# Altium schematic sheet RF_Antenna_Switch.SchDoc
size A4; DocumentNumber: 29; SheetNumber: 29; SheetTotal: 47
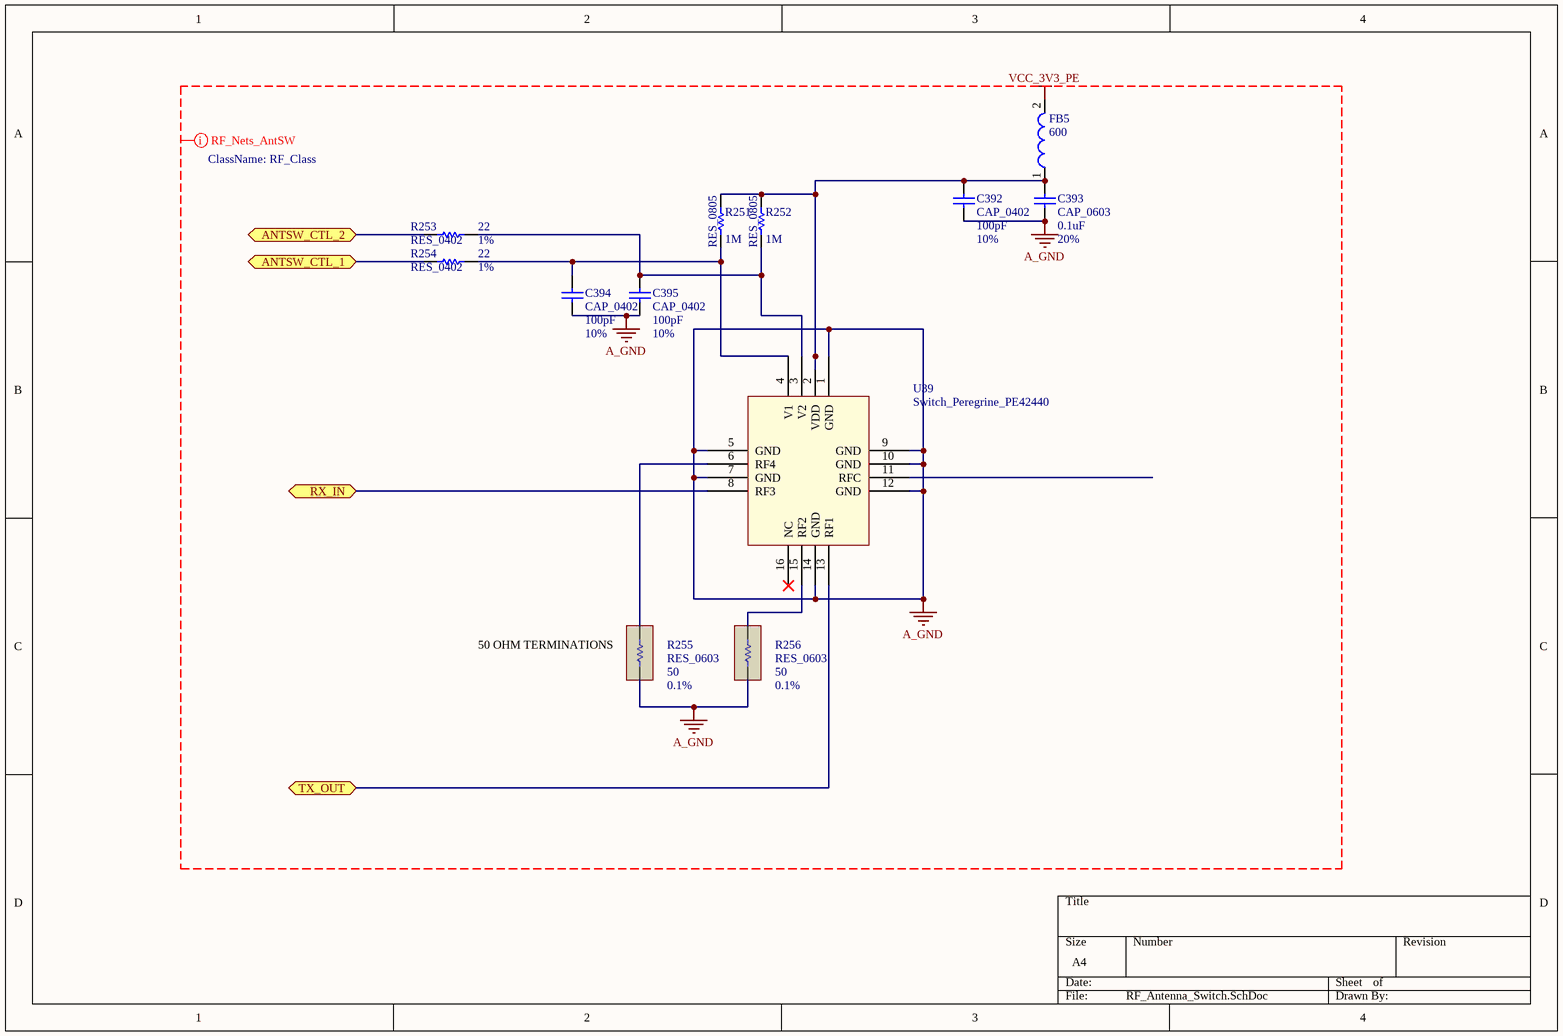
[diagram p0: RF_Antenna_Switch.SchDoc]

## Parts
C392  CAP_0402  value 100pF  Tolerance: 10%  [CAPC0402(1005)60_N]
C393  CAP_0603  value 0.1uF  Tolerance: 20%  [CAPC0603(1608)100_N]
C394  CAP_0402  value 100pF  Tolerance: 10%  [CAPC0402(1005)60_N]
C395  CAP_0402  value 100pF  Tolerance: 10%  [CAPC0402(1005)60_N]
FB5  Z: 600  [Inductor0402(1005)]  (hidden comment: FerriteBead)
R251  RES_0805  value 1M  [RESC0805(2012)_N]
R252  RES_0805  value 1M  [RESC0805(2012)_N]
R253  RES_0402  value 22  Tolerance: 1%  [RESC0402(1005)_N]
R254  RES_0402  value 22  Tolerance: 1%  [RESC0402(1005)_N]
R255  RES_0603  value 50  Tolerance: 0.1%  [RESC0603(1608)_N]
R256  RES_0603  value 50  Tolerance: 0.1%  [RESC0603(1608)_N]
U39  Switch_Peregrine_PE42440  [Switch_Peregrine_PE42440_16-QFN]

## Ports
ANTSW_CTL_1 (bidir), ANTSW_CTL_2 (bidir), RX_IN, TX_OUT

## Nets
A_GND: C392.1 C393.1 C394.1 C395.1 R255.1 R256.1 U39.1(GND) U39.5(GND) U39.7(GND) U39.9(GND) U39.10(GND) U39.12(GND) U39.14(GND)
VCC_3V3_PE: FB5.2
ANTSW_CTL_1: R254.1 ; port ANTSW_CTL_1
ANTSW_CTL_2: R253.1 ; port ANTSW_CTL_2
RX_IN: U39.8(RF3) ; port RX_IN
TX_OUT: U39.13(RF1) ; port TX_OUT
NetC392_2: C392.2 C393.2 FB5.1 R251.2 R252.2 U39.2(VDD)
NetC394_2: C394.2 R251.1 R254.2 U39.4(V1)
NetC395_2: C395.2 R252.1 R253.2 U39.3(V2)
NetR255_2: R255.2 U39.6(RF4)
NetR256_2: R256.2 U39.15(RF2)

Not connected (* = marked no-connect by the designer): U39 11(RFC) 16(NC)*

## Layout directives
net class RF_Class: A_GND, VCC_3V3_PE

## Notes on the sheet
- (near R255) 50 OHM TERMINATIONS

## Library data of the parts
C392 C394 C395 = 04026C101KAT2A: 100pF, ceramic, 10% 6.3V X7R, 0402; Manufacturer: AVX Corporation; Part Number: 04026C101KAT2A; Footprint Ref: CAPC0402(1005)60_N; Library Ref: CAP_0402
C393 = 6R3X14W104MV4T: CAP CER 0.1UF 6.3V 20% X7R 0603; Manufacturer: Johanson Dielectrics Inc; Part Number: 6R3X14W104MV4T; Footprint Ref: CAPC0603(1608)100_N; Library Ref: CAP_0603
FB5 = "MMZ1005S601C": Ferrite 300mA 600ohm 0402; Manufacturer: TDK; Value: "0 Ohm"; R: *; Current: *; Part Number: "MMZ1005S601C"
R251 R252 = 9C08052A1004JLHFT: 1M ohm, 5%, 1/8W, 0805; Manufacturer: Yageo America; Tolerance: 5%; Part Number: 9C08052A1004JLHFT; Footprint Ref: RESC0805(2012)_N; Library Ref: RES_0805
R253 R254 = ERJ-2RKF22R0X: RES 22.0 OHM 1/10W 1% 0402 SMD; Manufacturer: Panasonic Electronic Components; Part Number: ERJ-2RKF22R0X
R255 R256 = FC0603E50R0BTBST1: RES 50 OHM 125MW .1% 0603 SMD; Manufacturer: Vishay Thin Film; Part Number: FC0603E50R0BTBST1; Footprint Ref: RESC0603(1608)_N; Library Ref: RES_0603
U39 = PE42440MLBB-Z: SP4T UltraCMOS RF Switch, 50 - 3000 MHz, Isolation 34dB, Insertion loss 0.45 dB,16QFN; Part Number: PE42440MLBB-Z; Manufacturer: Peregrine